# Altium schematic sheet Schematic.SchDoc
size A4
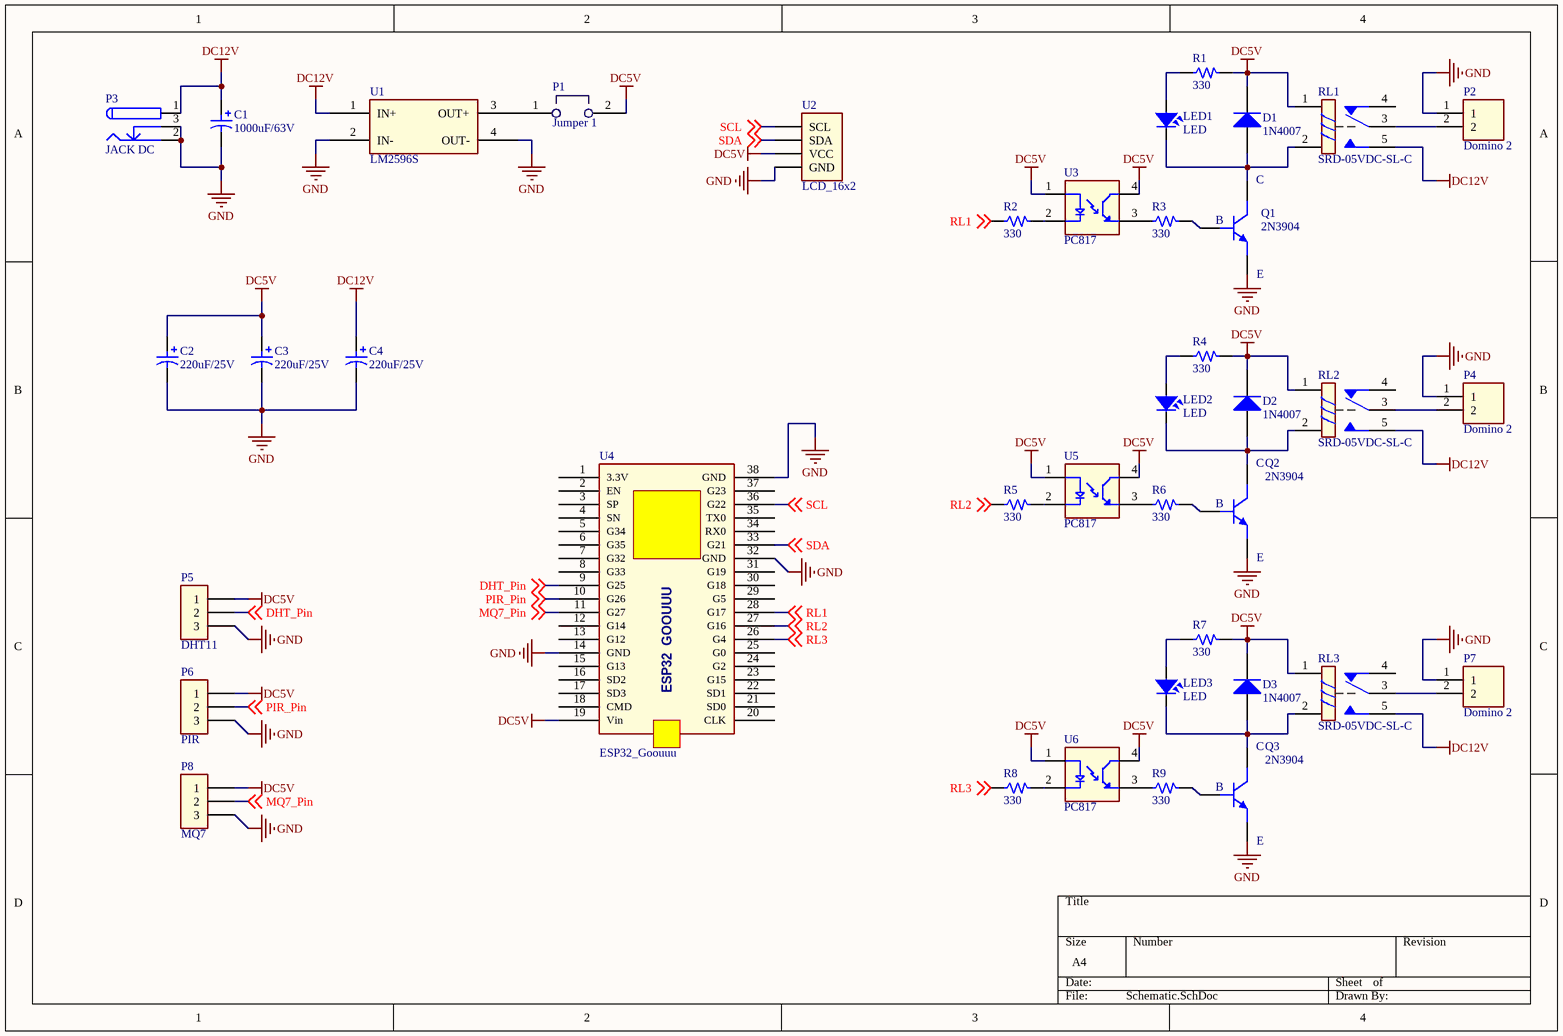
[diagram p0: Schematic.SchDoc]

## Parts
C1  1000uF/63V  [CAP-ALUM-12.5x25]
C2  220uF/25V  [CAP-ALUM-10x12.5]
C3  220uF/25V  [CAP-ALUM-10x12.5]
C4  220uF/25V  [CAP-ALUM-10x12.5]
D1  1N4007  [DO-41]
D2  1N4007  [DO-41]
D3  1N4007  [DO-41]
LED1  LED  [LED-5mm-Red]
LED2  LED  [LED-5mm-Red]
LED3  LED  [LED-5mm-Red]
P1  Jumper 1  [Jumper-1]
P2  Domino 2  [Domino-2]
P3  JACK DC  [DC5.5/2.1]
P4  Domino 2  [Domino-2]
P5  DHT11  [B3B-XH-A]
P6  PIR  [B3B-XH-A]
P7  Domino 2  [Domino-2]
P8  MQ7  [B3B-XH-A]
Q1  2N3904  [TO92-3]
Q2  2N3904  [TO92-3]
Q3  2N3904  [TO92-3]
R1  330  [R1/4W-H2]
R2  330  [R1/4W-H2]
R3  330  [R1/4W-H2]
R4  330  [R1/4W-H2]
R5  330  [R1/4W-H2]
R6  330  [R1/4W-H2]
R7  330  [R1/4W-H2]
R8  330  [R1/4W-H2]
R9  330  [R1/4W-H2]
RL1  SRD-05VDC-SL-C  [SRD-05VDC-SL-C]
RL2  SRD-05VDC-SL-C  [SRD-05VDC-SL-C]
RL3  SRD-05VDC-SL-C  [SRD-05VDC-SL-C]
U1  LM2596S  [Module-LM2596S]
U2  LCD_16x2  [LCD-I2C-16X2 (1)]
U3  PC817  [DIP-4]
U4  ESP32_Goouuu  [Kit-ESP32-GOOUUU]
U5  PC817  [DIP-4]
U6  PC817  [DIP-4]

## Nets
DC5V: C2.1 C3.1 D1.2(K) D2.2(K) D3.2(K) P1.2 P5.1 P6.1 P8.1 R1.2 R4.2 R7.2 RL1.1 RL2.1 RL3.1 U2.3(VCC) U3.1(A) U3.4(CT) U4.19(Vin) U5.1(A) U5.4(CT) U6.1(A) U6.4(CT)
DC12V: C1.1 C4.1 P3.1 RL1.5 RL2.5 RL3.5 U1.1(IN+)
GND: C1.2 C2.2 C3.2 C4.2 P2.1(1) P3.2 P3.3 P4.1(1) P5.3 P6.3 P7.1(1) P8.3 Q1.1(E) Q2.1(E) Q3.1(E) U1.2(IN-) U1.4(OUT-) U2.4(GND) U4.14(GND) U4.32(GND) U4.38(GND)
DHT_Pin: P5.2 U4.9(G25) ; off-sheet DHT_Pin
MQ7_Pin: P8.2 U4.11(G27) ; off-sheet MQ7_Pin
PIR_Pin: P6.2 U4.10(G26) ; off-sheet PIR_Pin
RL1: R2.1 U4.28(G17) ; off-sheet RL1
RL2: R5.1 U4.27(G16) ; off-sheet RL2
RL3: R8.1 U4.26(G4) ; off-sheet RL3
SCL: U2.1(SCL) U4.36(G22) ; off-sheet SCL
SDA: U2.2(SDA) U4.33(G21) ; off-sheet SDA
NetD1_1: D1.1(A) LED1.2 Q1.3(C) RL1.2
NetD2_1: D2.1(A) LED2.2 Q2.3(C) RL2.2
NetD3_1: D3.1(A) LED3.2 Q3.3(C) RL3.2
NetLED1_1: LED1.1 R1.1
NetLED2_1: LED2.1 R4.1
NetLED3_1: LED3.1 R7.1
NetP1_1: P1.1 U1.3(OUT+)
NetP2_2: P2.2 RL1.3
NetP4_2: P4.2 RL2.3
NetP7_2: P7.2 RL3.3
NetQ1_2: Q1.2(B) R3.2
NetQ2_2: Q2.2(B) R6.2
NetQ3_2: Q3.2(B) R9.2
NetR2_2: R2.2 U3.2(C)
NetR3_1: R3.1 U3.3(ET)
NetR5_2: R5.2 U5.2(C)
NetR6_1: R6.1 U5.3(ET)
NetR8_2: R8.2 U6.2(C)
NetR9_1: R9.1 U6.3(ET)

Not connected (* = marked no-connect by the designer): RL1 4; RL2 4; RL3 4; U4 1(3.3V) 2(EN) 3(SP) 4(SN) 5(G34) 6(G35) 7(G32) 8(G33) 12(G14) 13(G12) 15(G13) 16(SD2) 17(SD3) 18(CMD) 20(CLK) 21(SD0) 22(SD1) 23(G15) 24(G2) 25(G0) 29(G5) 30(G18) 31(G19) 34(RX0) 35(TX0) 37(G23)

## Notes on the sheet
- (in symbol Kit-ESP32-Goouuu) ESP32  GOOUUU

## Library data of the parts
C1 = EEUHD1H102B: Capacitor Aluminum 1000uF 20% 50V Radial; Value: 1000uF/63V
C2-C4 = EEUTA1E221: Capacitor Aluminum 220uF 20% 25V Radial; Value: 220uF/25V
D1-D3 = 1N4007: Diode 1N4007; Value: 1N4007
LED1-LED3 = LED-5MM: LED Single colour; Value: LED
P1 = Jumper-1: Value: Jumper 1
P2 P4 P7 = Domino-2: Value: Domino 2
P3 = DC-5.5/2.1: Low Voltage Power Supply Connector; Value: JACK DC
P5 P6 P8 = B3B-XH-A: Connector Header Through Hole 3 position 0.098" (2.50mm); Value: B3B-XH-A
Q1-Q3 = 2N3904: Bipolar (BJT) Transistor NPN 40V 200 mA 300MHz 625 mW Through Hole TO-92; Value: 2N3904
R1-R9 = RES-1/4W: Resistor 1/4W Through Hole; Value: 330
RL1-RL3 = SRD-05VDC-SL-C: Relay 5V; Value: SRD-05VDC-SL-C
U1 = Module-LM2596S: Module LM2596S; Value: LM2596S
U2 = LCD-I2C-16X2: Value: LCD_16x2
U3 U5 U6 = PC817: Optoisolator Transistor Output 1 Channel 4; Value: PC817
U4 = Kit-ESP32-Goouuu: Kit ESP32 Goouuu; Value: ESP32_Goouuu